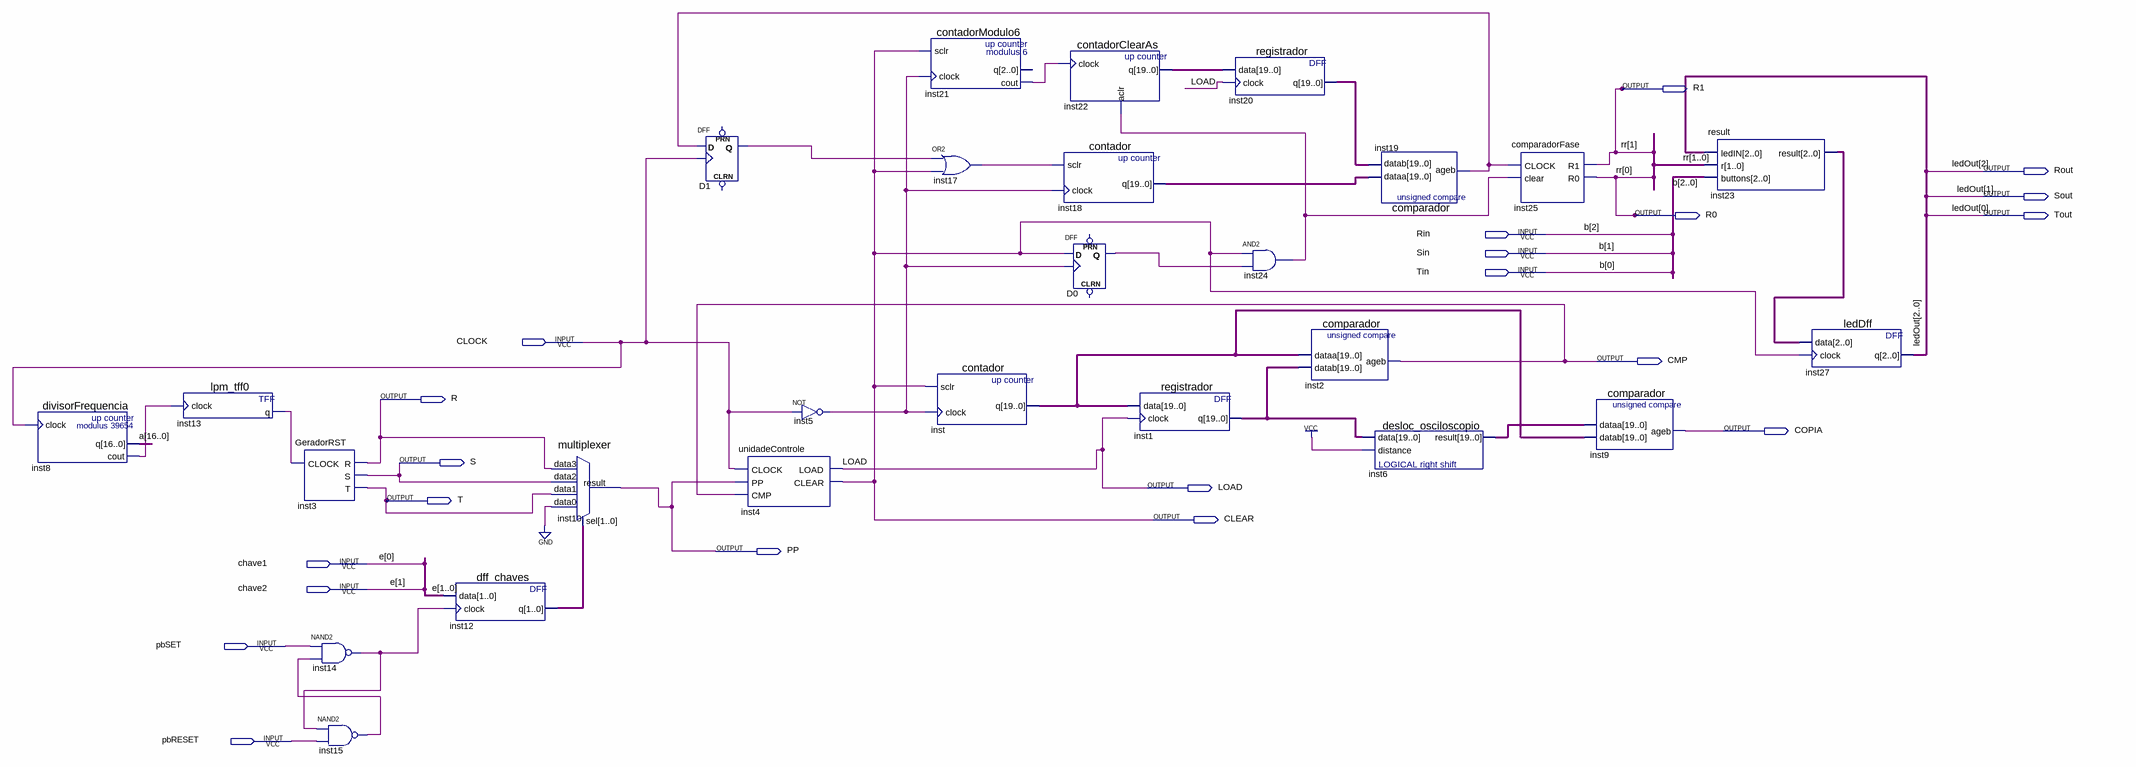
[diagram p0: schematic sheet]
// Quartus schematic LeitorRST.bdf as structural Verilog: 26 symbols, 21 pins
module LeitorRST (
  input  Rin,
  input  Sin,
  input  Tin,
  input  CLOCK,
  input  chave1,
  input  chave2,
  input  pbSET,
  input  pbRESET,
  output R1,
  output Rout,
  output Sout,
  output R0,
  output Tout,
  output CMP,
  output R,
  output COPIA,
  output S,
  output LOAD,
  output T,
  output CLEAR,
  output PP
);

  wire D0_q, D1_q, inst5_out, inst8_cout, inst13_q, inst14_out, inst15_out, inst17_out, inst19_ageb,
       inst21_cout, inst24_out;
  wire [1:0] inst12_q;
  wire [2:0] inst23_result;
  wire [16:0] a;
  wire [19:0] inst1_q, inst6_result, inst18_q, inst20_q, inst22_q, inst_q;

  divisorFrequencia inst8 (.clock(CLOCK), .q(a), .cout(inst8_cout));
  lpm_tff0 inst13 (.clock(inst8_cout), .q(inst13_q));
  GeradorRST inst3 (.CLOCK(inst13_q), .R(R), .S(S), .T(T));
  nand inst14 (inst14_out, pbSET, inst15_out);
  nand inst15 (inst15_out, inst14_out, pbRESET);
  dff_chaves inst12 (.data({chave2, chave1}), .clock(inst14_out), .q(inst12_q));
  multiplexer inst10 (.data3(R), .data2(S), .data1(T), .data0(1'b0), .sel(inst12_q), .result(PP));
  DFF D1 (.CLK(CLOCK), .D(inst19_ageb), .Q(D1_q));  // open: CLRN, PRN
  unidadeControle inst4 (.CLOCK(CLOCK), .PP(PP), .CMP(CMP), .LOAD(LOAD), .CLEAR(CLEAR));
  not inst5 (inst5_out, CLOCK);
  contadorModulo6 inst21 (.sclr(CLEAR), .clock(inst5_out), .cout(inst21_cout));  // open: q
  or inst17 (inst17_out, D1_q, CLEAR);
  contador inst (.sclr(CLEAR), .clock(inst5_out), .q(inst_q));
  contadorClearAs inst22 (.clock(inst21_cout), .aclr(inst24_out), .q(inst22_q));
  contador inst18 (.sclr(inst17_out), .clock(inst5_out), .q(inst18_q));
  DFF D0 (.CLK(inst5_out), .D(CLEAR), .Q(D0_q));  // open: CLRN, PRN
  registrador inst1 (.data(inst_q), .clock(LOAD), .q(inst1_q));
  registrador inst20 (.data(inst22_q), .clock(LOAD), .q(inst20_q));
  and inst24 (inst24_out, CLEAR, D0_q);
  comparador inst2 (.dataa(inst_q), .datab(inst1_q), .ageb(CMP));
  comparador inst19 (.dataa(inst18_q), .datab(inst20_q), .ageb(inst19_ageb));
  desloc_osciloscopio inst6 (.data(inst1_q), .distance(1'b1), .result(inst6_result));
  comparadorFase inst25 (.CLOCK(inst19_ageb), .clear(inst24_out), .R1(R1), .R0(R0));
  comparador inst9 (.dataa(inst6_result), .datab(inst_q), .ageb(COPIA));
  result inst23 (.ledIN({Rout, Sout, Tout}), .r({R1, R0}), .buttons({Rin, Sin, Tin}), .result(inst23_result));
  ledDff inst27 (.data(inst23_result), .clock(CLEAR), .q({Rout, Sout, Tout}));

  // Other names for the same wires on the sheet: b[2:0] = {Rin, Sin, Tin}; e[1:0] = {chave2, chave1};
  //   ledOut[2:0] = {Rout, Sout, Tout}; rr[1:0] = {R1, R0}
endmodule
